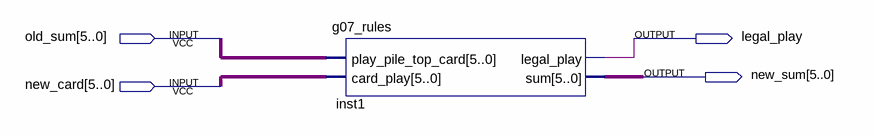
[diagram p0: schematic sheet]
// Quartus schematic g07_testing.bdf as structural Verilog: 1 symbols, 4 pins
module g07_testing (
  input  [5:0] old_sum,
  input  [5:0] new_card,
  output legal_play,
  output [5:0] new_sum
);

  g07_rules inst1 (.play_pile_top_card(old_sum), .card_play(new_card), .legal_play(legal_play), .sum(new_sum));
endmodule
